# Altium schematic sheet Practica 10 - ADC.SchDoc
size Legal; Engineer: Roberto Isaac Suaste Martinez; Organization: Mecatronica Digital; Address1: www.mecatronicadigital.com; Address2: info@mecatronicadigital.com; Address3: Dpto. Diseño Electronico
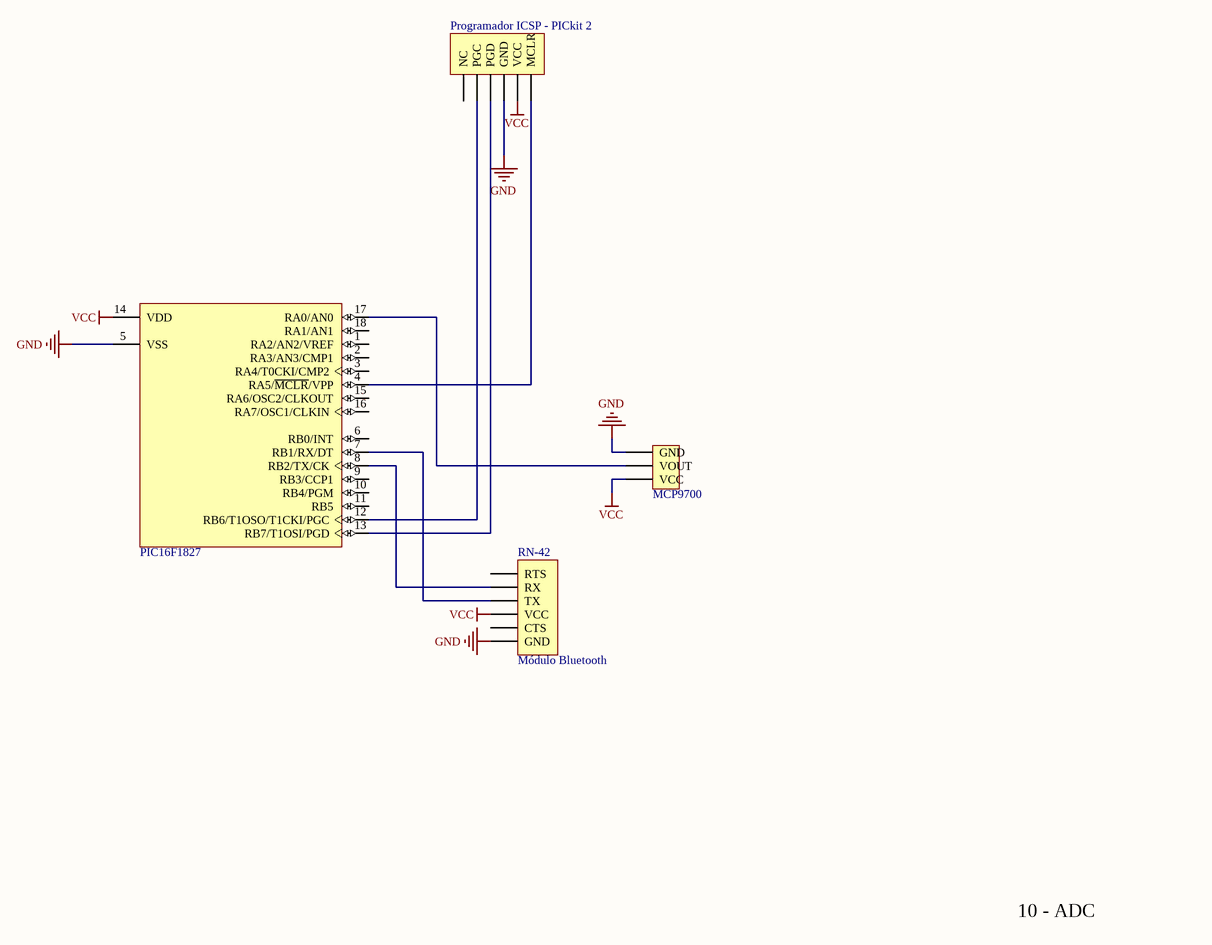
[diagram p0: Practica 10 - ADC.SchDoc]

## Parts
MCP9700  Borne 3  [BORNE3]  (value not drawn)
Programador_ICSP_-_PICkit_2  Header 6  [Header 1X6]  (value not drawn)
RN-42  Módulo Bluetooth  [Header 1X6]
U?  PIC16F1827  [PDIP300-P18]

## Nets
GND: MCP9700.1(GND) Programador_ICSP_-_PICkit_2.3(GND) RN-42.6(GND) U?.5(VSS)
VCC: MCP9700.3(VCC) Programador_ICSP_-_PICkit_2.2(VCC) RN-42.4(VCC) U?.14(VDD)
NetMCP9700_2: MCP9700.2(VOUT) U?.17(RA0/AN0)
NetProgramador_ICSP_-_PICkit_2_1: Programador_ICSP_-_PICkit_2.1(MCLR) U?.4(RA5/~{MCLR}/VPP)
NetProgramador_ICSP_-_PICkit_2_4: Programador_ICSP_-_PICkit_2.4(PGD) U?.13(RB7/T1OSI/PGD)
NetProgramador_ICSP_-_PICkit_2_5: Programador_ICSP_-_PICkit_2.5(PGC) U?.12(RB6/T1OSO/T1CKI/PGC)
NetRN-42_2: RN-42.2(RX) U?.8(RB2/TX/CK)
NetRN-42_3: RN-42.3(TX) U?.7(RB1/RX/DT)

Not connected (* = marked no-connect by the designer): Programador_ICSP_-_PICkit_2 6(NC); RN-42 5(CTS) RTS; U? 1(RA2/AN2/VREF) 2(RA3/AN3/CMP1) 3(RA4/T0CKI/CMP2) 6(RB0/INT) 9(RB3/CCP1) 10(RB4/PGM) 11(RB5) 15(RA6/OSC2/CLKOUT) 16(RA7/OSC1/CLKIN) 18(RA1/AN1)

## Notes on the sheet
- 10 - ADC
- Proyecto:
- Practica
- Ingeniero:
- Size:
- Fecha:
- A4
- Documento Numero:
- Hora:
- Revision:

## Library data of the parts
MCP9700 = Borne3: Terminal atornillable 3 salidas
Programador_ICSP_-_PICkit_2 RN-42 = Header 6: Header, 6-Pin; LatestRevisionDate: 17-Jul-2002; LatestRevisionNote: Re-released for DXP Platform.; Publisher: Altium Limited
U? = PIC16F628A-I/P: FLASH-Based 8-Bit CMOS Microcontroller with nanoWatt Technology, 2K (x14-Bit words) FLASH, 224 Bytes SRAM, 18-Pin PDIP, 3.0 to 5.5V Supply Range, Industrial Temperature; Published: 11-Oct-2004; LatestRevisionDate: 29-Jan-2009; LatestRevisionNote: Sch. layout revised. 3D Model Removed.; DatasheetVersion: revF, Mar-2007; PackageVersion: revBB, Aug-2009; PackageReference: PDIP300-P18; Publisher: Altium Limited; PackageDescription: 18-Lead Plastic Dual In-Line (P) - 300 mil Body [PDIP]; Supplier 1: Digi-Key; Supplier Part Number 1: PIC16F628A-I/P-ND; Supplier 2: Farnell; Supplier Part Number 2: 9771549; Supplier 3: Farnell; Supplier Part Number 3: 1523938; Supplier 4: Farnell; Supplier Part Number 4: 9760423; Code_JEDEC: MS-001; ComponentLink1Description: Datasheet; ComponentLink1URL: http://ww1.microchip.com/downloads/en/DeviceDoc/40044F.pdf; ComponentLink2Description: Packaging Specification; ComponentLink2URL: http://www.microchip.com/stellent/groups/techpub_sg/documents/packagingspec/en012702.pdf; ComponentLink3Description: Microchip.com Home; ComponentLink3URL: http://www.microchip.com/